# Altium schematic sheet 02_INDEX.SchDoc
size 297 x 209 mm
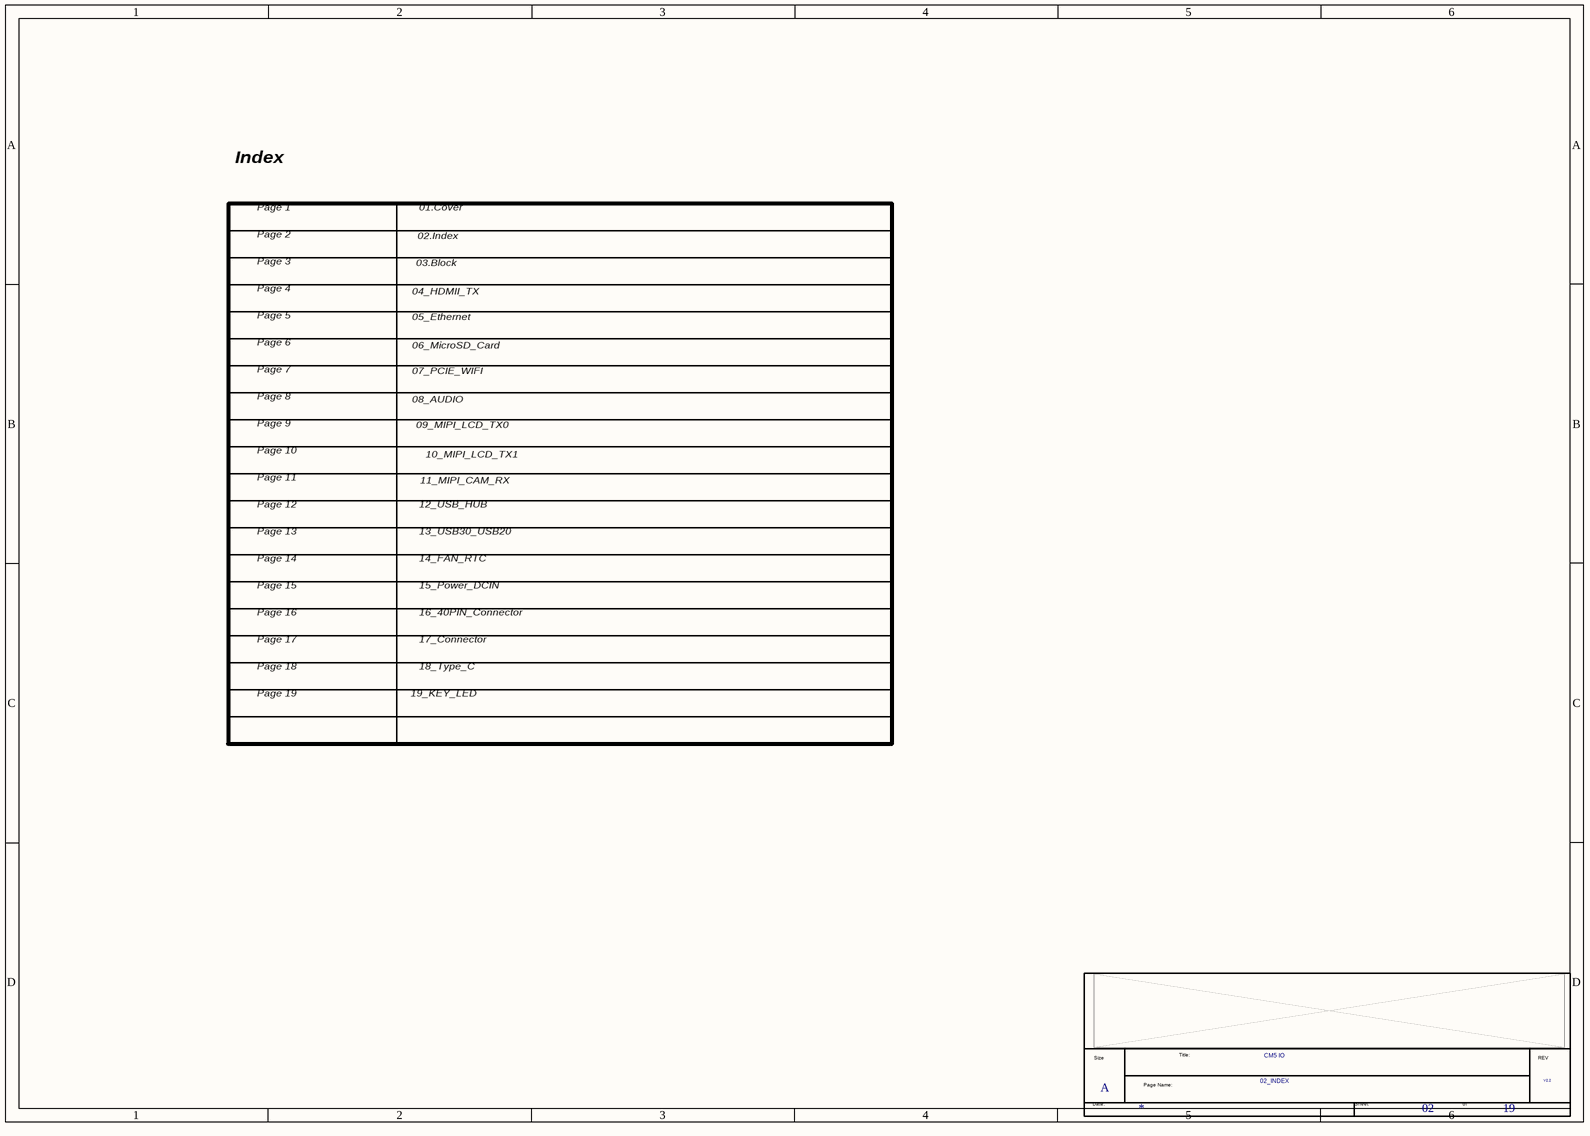
[diagram p0: 02_INDEX.SchDoc]

## Parts
*  Doc: 02_INDEX  RevCode: V2.2  Title: CM5 IO  Page Size: A  Page Number: 02  Page Count: 19  (hidden comment: radxa_1010)  (graphical)

## Notes on the sheet
- Index
- Page 1
- Page 3
- Page 2
- 03.Block
- 02.Index
- 01.Cover
- Page 5
- Page 4
- 05_Ethernet
- 04_HDMII_TX
- Page 8
- Page 6
- Page 7
- 06_MicroSD_Card
- 07_PCIE_WIFI
- 08_AUDIO
- Page 9
- Page 10
- 09_MIPI_LCD_TX0
- 10_MIPI_LCD_TX1
- Page 12
- Page 13
- Page 11
- 12_USB_HUB
- 13_USB30_USB20
- 11_MIPI_CAM_RX
- Page 14
- Page 15
- 15_Power_DCIN
- 14_FAN_RTC
- Page 18
- Page 16
- Page 17
- 16_40PIN_Connector
- 17_Connector
- 18_Type_C
- Page 19
- 19_KEY_LED
- (in symbol radxa_1010) Size; Title:; REV; Page Name:; Date:; Sheet; of

## Library data of the parts
* = radxa_1010: Page Create Date: March  8, 1995; Page Modify Date: *